# Altium schematic sheet MainBoard.SchDoc
size A4
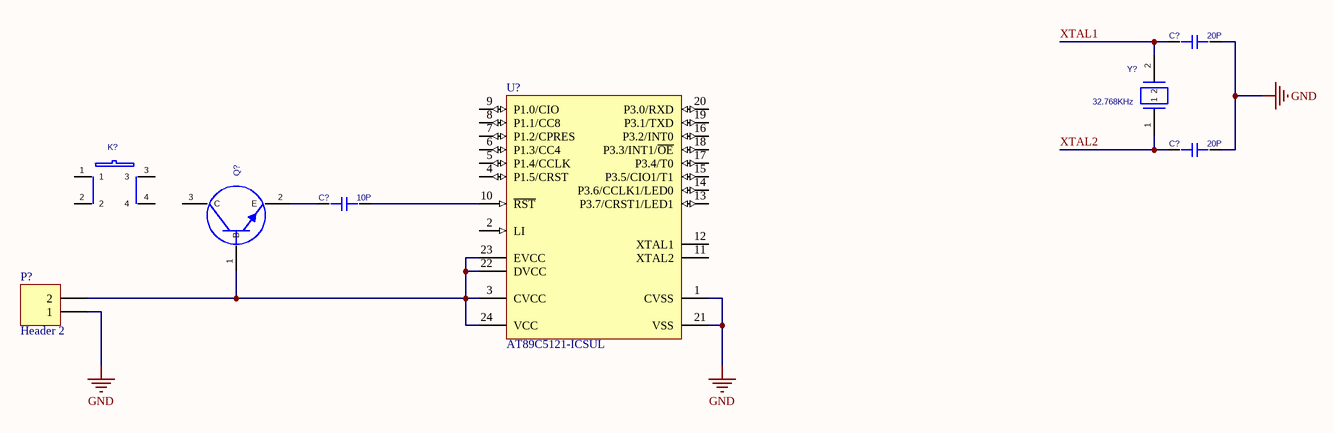
[diagram p0: MainBoard.SchDoc]

## Parts
(Parts that share a designator on the sheet are numbered #1, #2 ... from top to bottom, then left to right.)
C?#1  value 20P  [CAP_0603_FIRE]  (hidden comment: CAP_20P_0603_FIRE)
C?#2  value 20P  [CAP_0603_FIRE]  (hidden comment: CAP_20P_0603_FIRE)
C?#3  value 10P  [RES_0603_FIRE]  (hidden comment: CAP_10P_0603_FIRE)
K?  KEY  [SW6.2/6.2-SMD]  (value not drawn)
P?  Header 2  [HDR1X2]
Q?  8050  [SOT-23]  (value not drawn)
U?  AT89C5121-ICSUL  [SSOP24_N]
Y?  value 32.768KHz  [3215]  (hidden comment: XTAL_32.768KHZ_3215)

## Nets
GND: C?#1.2 C?#2.2 P?.1 U?.1(CVSS) U?.21(VSS)
XTAL1: C?#1.1 Y?.2
XTAL2: C?#2.1 Y?.1
NetC?#3_1: C?#3.1 Q?.2(E)
NetC?#3_2: C?#3.2 U?.10(~{RST})
NetP?_2: P?.2 Q?.1(B) U?.3(CVCC) U?.22(DVCC) U?.23(EVCC) U?.24(VCC)

Not connected (* = marked no-connect by the designer): K? 1 2 3 4; Q? 3(C); U? 2(LI) 4(P1.5/CRST) 5(P1.4/CCLK) 6(P1.3/CC4) 7(P1.2/CPRES) 8(P1.1/CC8) 9(P1.0/CIO) 11(XTAL2) 12(XTAL1) 13(P3.7/CRST1/LED1) 14(P3.6/CCLK1/LED0) 15(P3.5/CIO1/T1) 16(P3.2/INT0) 17(P3.4/T0) 18(P3.3/INT1/~{OE}) 19(P3.1/TXD) 20(P3.0/RXD)

## Library data of the parts
C?#3 = CAP_10P_0603_FIRE: 0603; Manufacture 1: SUPERCAP; Tolerance: +-5%; PCB DECAL: RES_0603_FIRE
P? = Header 2: Header, 2-Pin; LatestRevisionDate: 17-Jul-2002; LatestRevisionNote: Re-released for DXP Platform.; Publisher: Altium Limited
Q? = 8050: NPN; Manufacturer #2: 8050; PCB DECAL: SOT-23
U? = AT89C5121-ICSUL: 8-bit Microcontroller with Multiprotocol Smart Card Interface, Industrial, 24-Pin SOIC Pkg, Stick, Pb-Free; Published: 20-Sep-2010; DatasheetVersion: revG, July-2006; PackageVersion: 2006; PackageReference: SSOP24; Publisher: Altium Limited; PackageDescription: 24-Pin Shrink Small Outline Package, 8.2 x 5.3 mm Body, 0.65 mm Pitch; Supplier 1: Digi-Key; Supplier Part Number 1: AT89C5121-ICSUL-ND; Supplier 2: Mouser; Supplier Part Number 2: 556-A89C5121-ICSUL; Code_JEDEC: MO-150-AG; Code_IPC: SOP65P780-24; ComponentLink1Description: Manufacturer Link; ComponentLink1URL: http://www.atmel.com/products/overview_security.asp?; ComponentLink2Description: Datasheet; ComponentLink2URL: http://www.atmel.com/dyn/resources/prod_documents/doc4164.pdf; ComponentLink3Description: Atmel.com Home; ComponentLink3URL: http://www.atmel.com
Y? = XTAL_32.768KHZ_3215: CRYSTAL; PCB DECAL: 3215
C?#1 C?#2 = CAP_20P_0603_FIRE: PCB DECAL: CAP_0603_FIRE
K? = KEY: Manufacturer #1 PN: KEY; PCB DECAL: SW6.2/6.2-SMD